# Altium schematic sheet Photocoupler12Vinput.SchDoc: STM32F446 CNC
size B; Author: AM; CompanyName: Expatria Technologies; DrawnBy: A.Marles; Engineer: AM; Organization: Expatria Technolgoies; DocumentNumber: 14; SheetNumber: 14; SheetTotal: 14
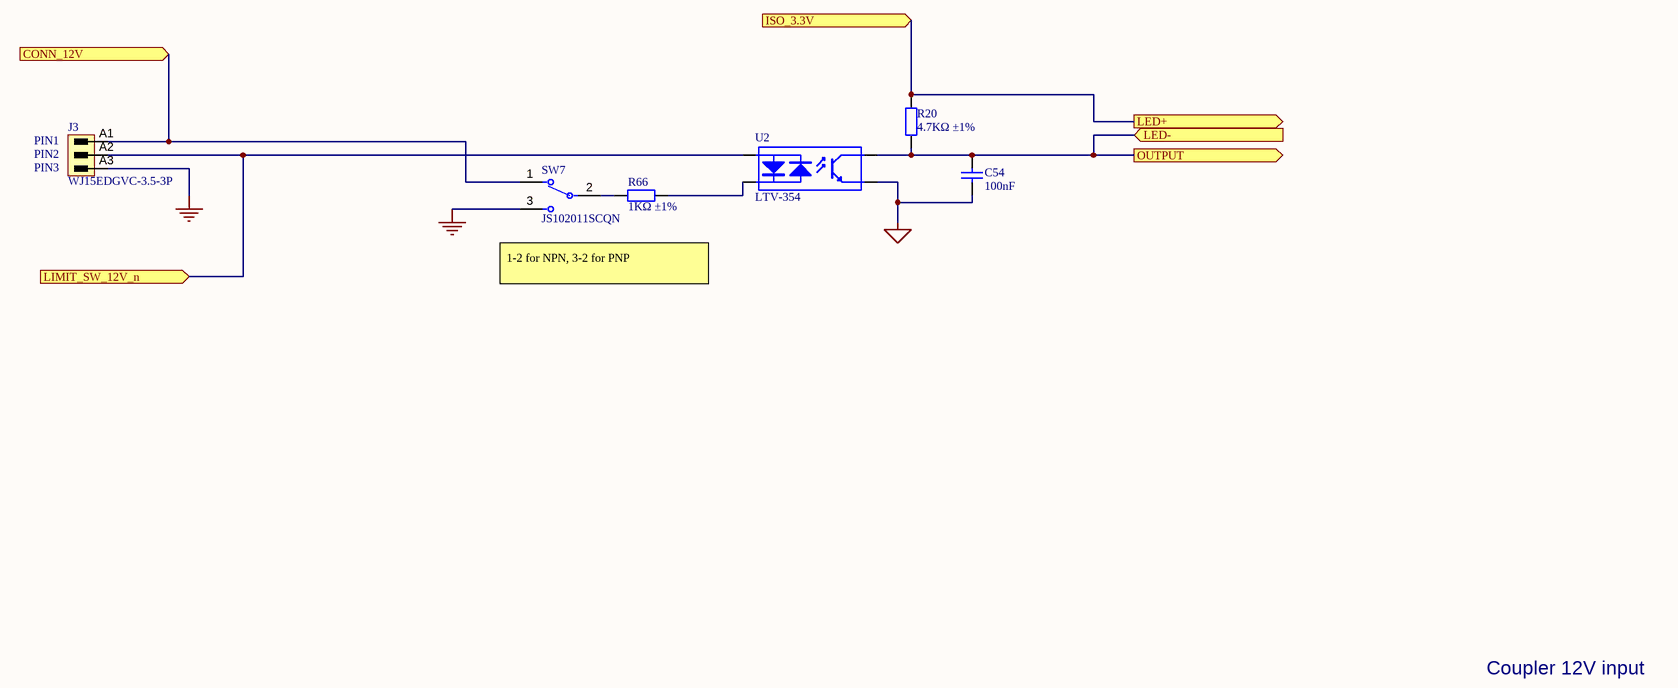
[diagram p0: Photocoupler12Vinput.SchDoc]

## Parts
C54  100nF  [0402_C]
J3  WJ15EDGVC-3.5-3P  [691321100003 - 3.5mm  3p]
R20  4.7KΩ ±1%  [0402_R]
R66  1KΩ ±1%  [0402_R]
SW7  JS102011SCQN  [FP-JS102011SCQN-MFG]
U2  LTV-354  [SOP-4_P2.54]

## Ports
CONN_12V (in), ISO_3.3V (in), LED+ (out), LED- (in), LIMIT_SW_12V_n (in), OUTPUT (out)

## Nets
GND: J3.A3 SW7.3
MCU_GND: C54.1 U2.3(E)
CONN_12V: J3.A1 SW7.1 ; port CONN_12V
ISO_3.3V: R20.2 ; port LED+, port ISO_3.3V
LED-: C54.2 R20.1 U2.4(C) ; port OUTPUT, port LED-
LIMIT_SW_12V_n: J3.A2 U2.1(A) ; port LIMIT_SW_12V_n
NetR66_1: R66.1 U2.2(K)
NetR66_2: R66.2 SW7.2(C)

## Notes on the sheet
- (near J3) PIN1
- (near J3) PIN2
- (near J3) PIN3
- 1-2 for NPN, 3-2 for PNP
- Coupler 12V input
- SHEET
- Expatria Technologies
- 1136 Glade Court
- Port Coquitlam, BC V3B 1R5
- PROJECT
- SIZE
- ENGR
- MODIFIED
- DOCUMENT
- REV
- Copyright Expatria Technologies 2022. This document describes Open Hardware and is licensed under the CERN-OHL-S v2. No warranty is implied or expressed.
- EMAIL: INFO@EXPATRIA.CA
- B
- /

## Library data of the parts
C54 = 0402 100nF (104) 10% 16V: Chip capacitors; Manufacturer: Samsung Electro-Mechanics; PartNumber: CL05B104KO5NNNC; Tolerance: 10%; Voltage: 16V; ComponentLink1Description: Supplier link; ComponentLink1URL: http://www.szlcsc.com/product/details_1877.html; Package: 0402; Supplier: LC; SuppliersPartNumber: C1525; Capacitance: 100nF
J3 = 3.5mm Terminal Header 3p: Header,Male Pin,Covered(4 Sided) 3 1 0.138"（3.50mm） 3 P=3.5mm Pluggable System Terminal Block RoHS; Manufacturer: Ningbo Kangnex Elec; Pitch_mm: 3.5 mm; UL_94_flammability_rating: V-0; Side_termination_characteristic: closed side; Solder_pin_length_mm: 3.2 mm; Short_text_for_material: SL 3.50/03/180G 3.2SN OR BX; Pitch_inch: 0.138 inch; PartNumber: WJ15EDGVC-3.5-3P; PackageReference: SL_3_50_180G_03; ComponentLink1URL: http://www.weidmueller.com/; ComponentLink1Description: Manufacturer URL; Packaging: Box; Revision: V1; SuppliersPartNumber: C192778; Manufacturer 1: Ningbo Kangnex Elec; Manufacturer Part Number 1: WJ15EDGVC-3.5-3P; Package: P=3.5mm
R20 = 0402 4.7K (4701) 1%: Chip resistor; Manufacturer: Uniroyal Elec; PartNumber: 0402WGF4701TCE; Power: 1/16W; ComponentLink1Description: Supplier link; ComponentLink1URL: http://www.szlcsc.com/product/details_26643.html; Package: 0402; Supplier: LC; SuppliersPartNumber: C25900; Resistance: 4.7KΩ; Tolerance: 1%
R66 = 0402 1K (1001) 1%: Chip resistor; Manufacturer: Uniroyal Elec; PartNumber: 0402WGF1001TCE; Power: 1/16W; ComponentLink1Description: Supplier link; ComponentLink1URL: http://www.szlcsc.com/product/details_12256.html; Package: 0402; Supplier: LC; SuppliersPartNumber: C11702; Resistance: 1KΩ; Tolerance: 1%
SW7 = CMP-00007-1: Switch Slide SPDT Top Slide 0.3A 30VDC Gull Wing SMD T/R; Manufacturer 1: C&K; SuppliersPartNumber: C221661; Manufacturer Part Number 1: JS102011SCQN
U2 = LTV-354: 35V 3.75kV 50mA 100mV@1mA,20mA 1 1.2V AC,DC SOP-4-2.54mm Transistor, Photovoltaic Output Optoisolators ROHS; Package: SOP-4_P2.54; Supplier: LC; SuppliersPartNumber: C10802